# EAGLE schematic IR4427 (EAGLE 9.0.0)
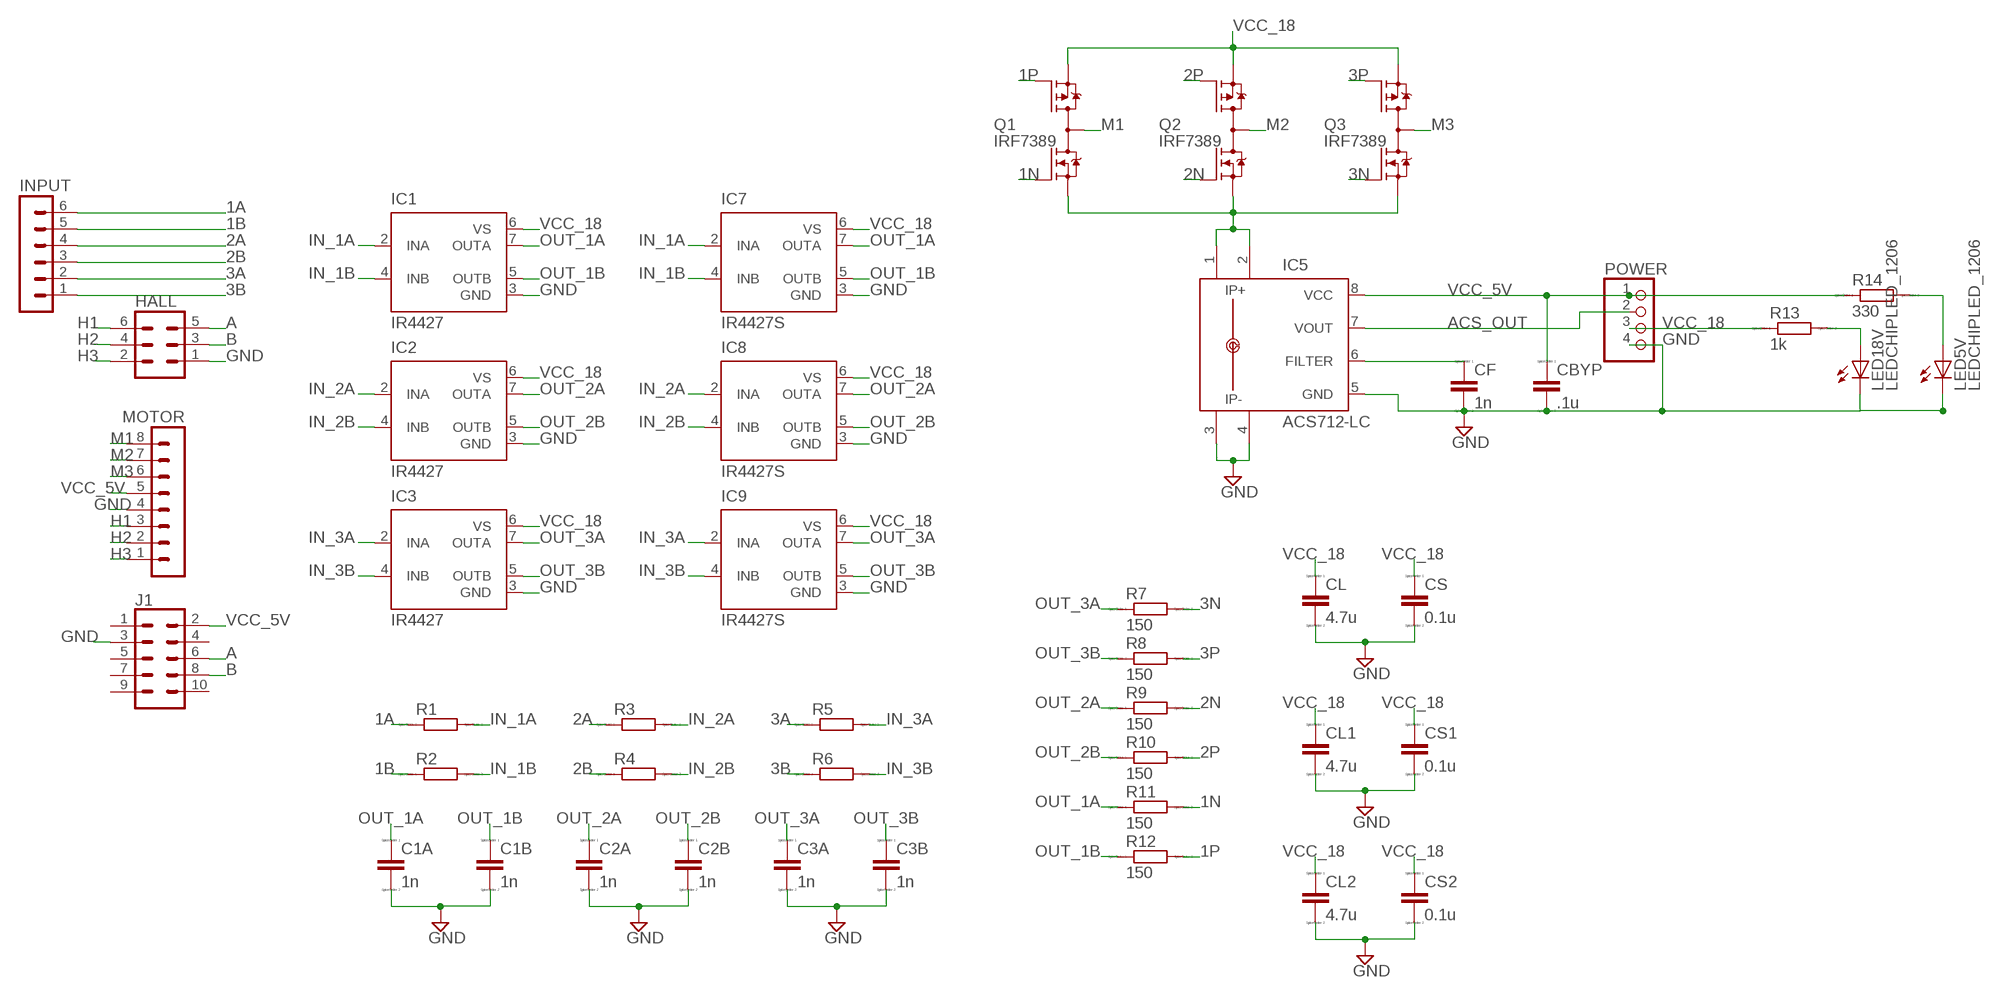
[diagram p0: schematic, sheet 1]

## Parts
C1A  1n  CC1206  [C1206]
C1B  1n  CC1206  [C1206]
C2A  1n  CC1206  [C1206]
C2B  1n  CC1206  [C1206]
C3A  1n  CC1206  [C1206]
C3B  1n  CC1206  [C1206]
CBYP  .1u  CC1206  [C1206]
CF  1n  CC1206  [C1206]
CL  4.7u  CC1206  [C1206]
CL1  4.7u  CC1206  [C1206]
CL2  4.7u  CC1206  [C1206]
CS  0.1u  CC1206  [C1206]
CS1  0.1u  CC1206  [C1206]
CS2  0.1u  CC1206  [C1206]
HALL  MA03-2  [MA03-2]
IC1  IR4427  [DIL08]
IC2  IR4427  [DIL08]
IC3  IR4427  [DIL08]
IC5  ACS712-LC  [SOIC8]
IC7  IR4427S  [SO08]
IC8  IR4427S  [SO08]
IC9  IR4427S  [SO08]
INPUT  MA06-1  [MA06-1]
J1  CONN_05X2SHD_LOCK  [2X5-SHROUDED_LOCK]
LED5V  LEDCHIPLED_1206  [CHIPLED_1206]
LED18V  LEDCHIPLED_1206  [CHIPLED_1206]
MOTOR  MA08-1  [MA08-1]
POWER  PINHD-1X4  [1X04]
Q1  IRF7389  [SO08-IRF]
Q2  IRF7389  [SO08-IRF]
Q3  IRF7389  [SO08-IRF]
R1  RR1206  [R1206]
R2  RR1206  [R1206]
R3  RR1206  [R1206]
R4  RR1206  [R1206]
R5  RR1206  [R1206]
R6  RR1206  [R1206]
R7  150  RR1206  [R1206]
R8  150  RR1206  [R1206]
R9  150  RR1206  [R1206]
R10  150  RR1206  [R1206]
R11  150  RR1206  [R1206]
R12  150  RR1206  [R1206]
R13  1k  RR1206  [R1206]
R14  330  RR1206  [R1206]

## Nets
1A [signal]: INPUT.6 R1.1
1B [signal]: INPUT.5 R2.1
1N [signal]: Q1.2(N-G) R11.2
1P [signal]: Q1.4(P-G) R12.2
2A [signal]: INPUT.4 R3.1
2B [signal]: INPUT.3 R4.1
2N [signal]: Q2.2(N-G) R9.2
2P [signal]: Q2.4(P-G) R10.2
3A [signal]: INPUT.2 R5.1
3B [signal]: INPUT.1 R6.1
3N [signal]: Q3.2(N-G) R7.2
3P [signal]: Q3.4(P-G) R8.2
A [signal]: HALL.5 J1.6
ACS_OUT [signal]: IC5.7(VOUT) POWER.2
B [signal]: HALL.3 J1.8
GND [gnd]: C1A.2 C1B.2 C2A.2 C2B.2 C3A.2 C3B.2 CBYP.2 CF.2 CL1.2 CL2.2 CL.2 CS1.2 CS2.2 CS.2 HALL.1 IC1.3(GND) IC2.3(GND) IC3.3(GND) IC5.3(IP-) IC5.4(IP-1) IC5.5(GND) IC7.3(GND) IC8.3(GND) IC9.3(GND) J1.3 LED5V.C LED18V.C MOTOR.4 POWER.4
H1 [signal]: HALL.6 MOTOR.3
H2 [signal]: HALL.4 MOTOR.2
H3 [signal]: HALL.2 MOTOR.1
IN_1A [signal]: IC1.2(INA) IC7.2(INA) R1.2
IN_1B [signal]: IC1.4(INB) IC7.4(INB) R2.2
IN_2A [signal]: IC2.2(INA) IC8.2(INA) R3.2
IN_2B [signal]: IC2.4(INB) IC8.4(INB) R4.2
IN_3A [signal]: IC3.2(INA) IC9.2(INA) R5.2
IN_3B [signal]: IC3.4(INB) IC9.4(INB) R6.2
M1 [motor]: MOTOR.8 Q1.5(D) Q1.6(D) Q1.7(D) Q1.8(D)
M2 [motor]: MOTOR.7 Q2.5(D) Q2.6(D) Q2.7(D) Q2.8(D)
M3 [motor]: MOTOR.6 Q3.5(D) Q3.6(D) Q3.7(D) Q3.8(D)
N$1 [signal]: IC5.1(IP+) IC5.2(IP+1) Q1.1(N-S) Q2.1(N-S) Q3.1(N-S)
N$2 [5v]: LED18V.A R13.2
N$3 [5v]: CF.1 IC5.6(FILTER)
N$4 [signal]: LED5V.A R14.2
OUT_1A [signal]: C1A.1 IC1.7(OUTA) IC7.7(OUTA) R11.1
OUT_1B [signal]: C1B.1 IC1.5(OUTB) IC7.5(OUTB) R12.1
OUT_2A [signal]: C2A.1 IC2.7(OUTA) IC8.7(OUTA) R9.1
OUT_2B [signal]: C2B.1 IC2.5(OUTB) IC8.5(OUTB) R10.1
OUT_3A [signal]: C3A.1 IC3.7(OUTA) IC9.7(OUTA) R7.1
OUT_3B [signal]: C3B.1 IC3.5(OUTB) IC9.5(OUTB) R8.1
VCC_5V [5v]: CBYP.1 IC5.8(VCC) J1.2 MOTOR.5 POWER.1 R14.1
VCC_18 [motor]: CL1.1 CL2.1 CL.1 CS1.1 CS2.1 CS.1 IC1.6(VS) IC2.6(VS) IC3.6(VS) IC7.6(VS) IC8.6(VS) IC9.6(VS) POWER.3 Q1.3(P-S) Q2.3(P-S) Q3.3(P-S) R13.1
Unconnected: J1.1 J1.4 J1.5 J1.7 J1.9 J1.10

## Library data of the parts
C1A C1B C2A C2B C3A C3B CBYP CF CL CL1 CL2 CS CS1 CS2 = eagle-ltspice:C: CAPACITOR, European symbol; SPICEMODEL: NONE; SPICEPREFIX: C
HALL = con-lstb:MA03-2: PIN HEADER; OC_FARNELL: unknown; OC_NEWARK: unknown
IC1-IC3 = ir:IR4427: DUAL LOW SIDE DRIVER Source: ID4426.pdf; MF: INTERNATIONAL RECTIFIER(IR); MPN: IR4427; OC_FARNELL: 1023267; OC_NEWARK: 27C6914
IC5 = allegro-2:ACS712-LC
IC7-IC9 = ir:IR4427: DUAL LOW SIDE DRIVER Source: ID4426.pdf; MF: INTERNATIONAL RECTIFIER(IR); MPN: IR4427STRPBF; OC_FARNELL: 8639094; OC_NEWARK: 63J7933
INPUT = con-lstb:MA06-1: PIN HEADER; OC_FARNELL: unknown; OC_NEWARK: unknown
J1 = SparkFun-Connectors:CONN_05X2: Multi connection point. Often used as Generic Header-pin footprint for 0.1 inch spaced/style header connections For AVR SPI programming port, see special device with nice symbol: "AVR_SPI_PROG_5x2.dev" You can populate with any combo of single row headers, but if you'd like an exact match, check these: 2x5 AVR ICSP Male Header <https://www.sparkfun.com/products/778> (PRT-00778) 2x5 Pin Shrouded Header <https://www.sparkfun.com/products/8506> (PRT-08506) On any of the 0.1 inch spaced packages, you can populate with these: Break Away Headers - Straight <https://www.sparkfun.com/products/116> (PRT-00116) Break Away Male Headers - Right Angle <https://www.sparkfun.com/products/553> (PRT-00553) Female Headers <https://www.sparkfun.com/products/115> (PRT-00115) Break Away Headers - Machine Pin <https://www.sparkfun.com/products/117> (PRT-00117) Break Away Female Headers - Swiss Machine Pin <https://www.sparkfun.com/products/743> (PRT-00743) Special note: the shrouded connector mates well with our 5x2 ribbon cables: 2x5 Pin IDC Ribbon Cable <https://www.sparkfun.com/products/8535> (PRT-08535); PROD_ID: CONN-08671; SF_ID: PRT-08506
LED5V LED18V = audio amplifier example:LED
MOTOR = con-lstb:MA08-1: PIN HEADER; OC_FARNELL: unknown; OC_NEWARK: unknown
POWER = pinhead:PINHD-1X4: PIN HEADER
Q1-Q3 = transistor-fet:IRF7389: Complimentary Half Bridge HEXFET Power MOSFET Source: http://www.irf.com/product-info/datasheets/data/irf7389.pdf
R1-R14 = eagle-ltspice:R: RESISTOR, European symbol; SPICEMODEL: NONE; SPICEPREFIX: R

## Net classes
0 18v: width 1.4 mm, drill 0.4 mm, clearance 0.152 mm
1 5v: width 0.4 mm, drill 0.4 mm, clearance 0.152 mm
2 motor: width 1.4 mm, drill 0.4 mm, clearance 0.152 mm
3 signal: width 0.3 mm, drill 0.4 mm, clearance 0.152 mm
4 gnd: width 1.4 mm, drill 0.4 mm, clearance 0.152 mm